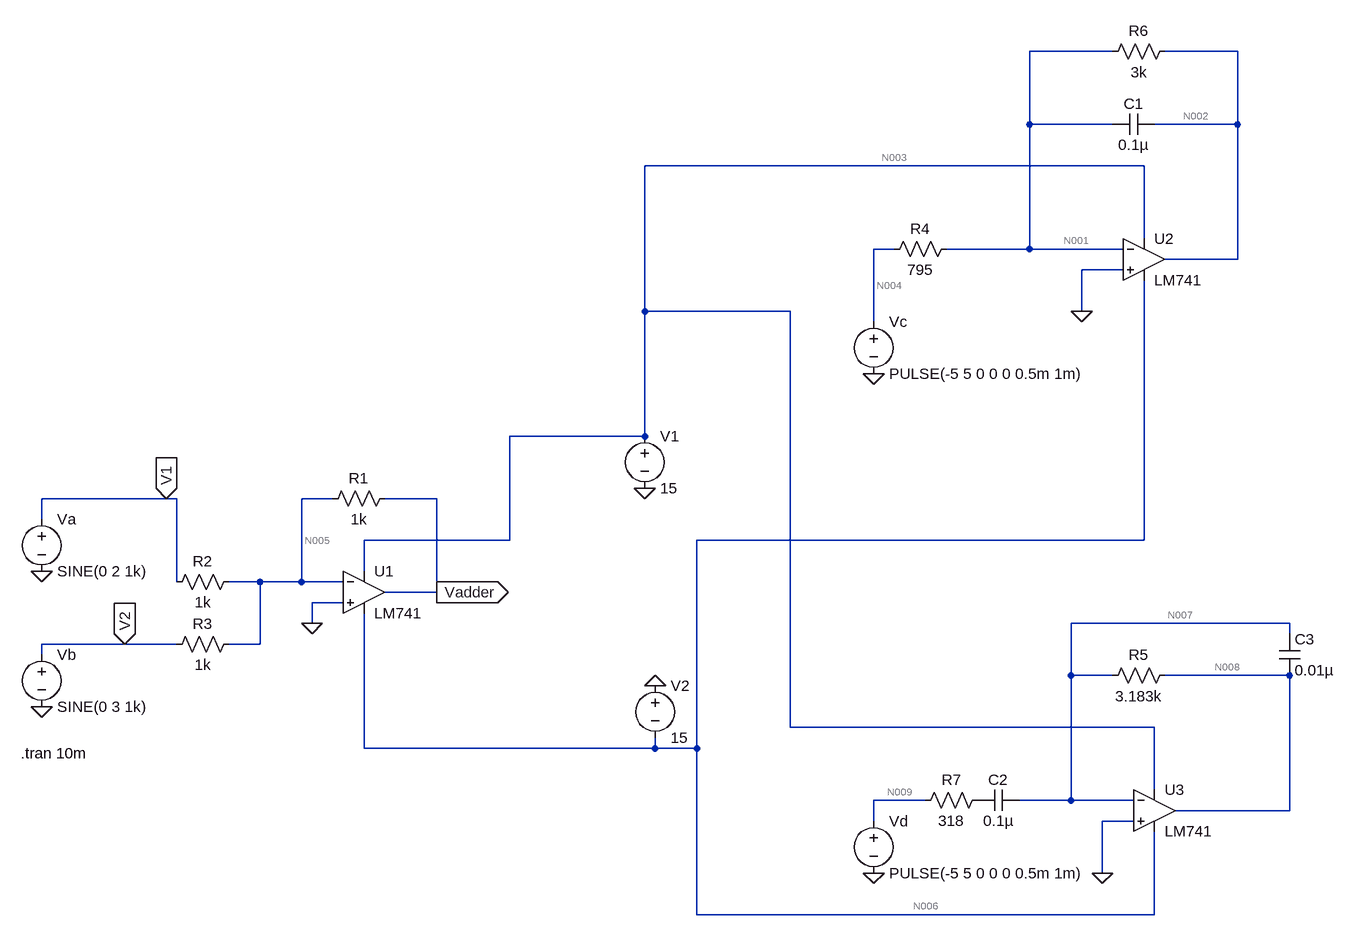
[diagram p0: schematic Opamp_Math_applications.asc]
Opamp_Math_applications.asc, the LTspice schematic file:
Version 4
SHEET 1 1788 680
WIRE 1440 -656 1312 -656
WIRE 1632 -656 1520 -656
WIRE 1312 -544 1312 -656
WIRE 1440 -544 1312 -544
WIRE 1632 -544 1632 -656
WIRE 1632 -544 1504 -544
WIRE 1488 -480 720 -480
WIRE 1488 -368 1488 -480
WIRE 1104 -352 1072 -352
WIRE 1312 -352 1312 -544
WIRE 1312 -352 1184 -352
WIRE 1456 -352 1312 -352
WIRE 1632 -336 1632 -544
WIRE 1632 -336 1520 -336
WIRE 1456 -320 1392 -320
WIRE 720 -256 720 -480
WIRE 944 -256 720 -256
WIRE 1392 -256 1392 -320
WIRE 1072 -240 1072 -352
WIRE 720 -64 720 -256
WIRE 720 -64 512 -64
WIRE -16 32 -208 32
WIRE 0 32 -16 32
WIRE 240 32 192 32
WIRE 400 32 320 32
WIRE -208 64 -208 32
WIRE 512 96 512 -64
WIRE 512 96 288 96
WIRE 1488 96 1488 -304
WIRE 1488 96 800 96
WIRE 288 144 288 96
WIRE 0 160 0 32
WIRE 128 160 80 160
WIRE 192 160 192 32
WIRE 192 160 128 160
WIRE 256 160 192 160
WIRE 400 176 400 32
WIRE 400 176 320 176
WIRE 256 192 208 192
WIRE 208 224 208 192
WIRE 1712 224 1376 224
WIRE 1712 240 1712 224
WIRE -80 256 -208 256
WIRE 0 256 -80 256
WIRE 128 256 128 160
WIRE 128 256 80 256
WIRE -208 272 -208 256
WIRE 1376 304 1376 224
WIRE 1440 304 1376 304
WIRE 1712 304 1520 304
WIRE 944 384 944 -256
WIRE 1504 384 944 384
WIRE 288 416 288 208
WIRE 736 416 736 400
WIRE 736 416 288 416
WIRE 800 416 800 96
WIRE 800 416 736 416
WIRE 1504 480 1504 384
WIRE 1152 496 1072 496
WIRE 1376 496 1376 304
WIRE 1376 496 1296 496
WIRE 1472 496 1376 496
WIRE 1712 512 1712 304
WIRE 1712 512 1536 512
WIRE 1072 528 1072 496
WIRE 1472 528 1424 528
WIRE 1424 608 1424 528
WIRE 800 672 800 416
WIRE 1504 672 1504 544
WIRE 1504 672 800 672
FLAG 736 320 0
FLAG 720 16 0
FLAG 208 224 0
FLAG 400 176 Vadder
IOPIN 400 176 Out
FLAG -208 144 0
FLAG -208 352 0
FLAG -16 32 V1
IOPIN -16 32 In
FLAG -80 256 V2
IOPIN -80 256 In
FLAG 1392 -256 0
FLAG 1424 608 0
FLAG 1072 608 0
FLAG 1072 -160 0
SYMBOL OpAmps\\LM741 288 112 R0
SYMATTR InstName U1
SYMBOL voltage 720 -80 R0
SYMATTR InstName V1
SYMATTR Value 15
SYMBOL voltage 736 304 R0
SYMATTR InstName V2
SYMATTR Value 15
SYMBOL res 336 16 R90
WINDOW 0 0 56 VBottom 2
WINDOW 3 32 56 VTop 2
SYMATTR InstName R1
SYMATTR Value 1k
SYMBOL res 96 144 R90
WINDOW 0 0 56 VBottom 2
WINDOW 3 32 56 VTop 2
SYMATTR InstName R2
SYMATTR Value 1k
SYMBOL res 96 240 R90
WINDOW 0 0 56 VBottom 2
WINDOW 3 32 56 VTop 2
SYMATTR InstName R3
SYMATTR Value 1k
SYMBOL voltage -208 48 R0
WINDOW 123 0 0 Left 0
WINDOW 39 0 0 Left 0
SYMATTR InstName Va
SYMATTR Value SINE(0 2 1k)
SYMBOL voltage -208 256 R0
WINDOW 123 0 0 Left 0
WINDOW 39 0 0 Left 0
SYMATTR InstName Vb
SYMATTR Value SINE(0 3 1k)
SYMBOL OpAmps\\LM741 1488 -400 R0
SYMATTR InstName U2
SYMBOL OpAmps\\LM741 1504 448 R0
SYMATTR InstName U3
SYMBOL res 1200 -368 R90
WINDOW 0 0 56 VBottom 2
WINDOW 3 32 56 VTop 2
SYMATTR InstName R4
SYMATTR Value 795
SYMBOL res 1536 288 R90
WINDOW 0 0 56 VBottom 2
WINDOW 3 32 56 VTop 2
SYMATTR InstName R5
SYMATTR Value 3.183k
SYMBOL cap 1504 -560 R90
WINDOW 0 0 32 VBottom 2
WINDOW 3 32 32 VTop 2
SYMATTR InstName C1
SYMATTR Value 0.1µ
SYMBOL cap 1296 480 R90
WINDOW 0 0 32 VBottom 2
WINDOW 3 32 32 VTop 2
SYMATTR InstName C2
SYMATTR Value 0.1µ
SYMBOL voltage 1072 -256 R0
WINDOW 123 0 0 Left 0
WINDOW 39 0 0 Left 0
SYMATTR InstName Vc
SYMATTR Value PULSE(-5 5 0 0 0 0.5m 1m)
SYMBOL voltage 1072 512 R0
WINDOW 123 0 0 Left 0
WINDOW 39 0 0 Left 0
SYMATTR InstName Vd
SYMATTR Value PULSE(-5 5 0 0 0 0.5m 1m)
SYMBOL res 1536 -672 R90
WINDOW 0 0 56 VBottom 2
WINDOW 3 32 56 VTop 2
SYMATTR InstName R6
SYMATTR Value 3k
SYMBOL res 1248 480 R90
WINDOW 0 0 56 VBottom 2
WINDOW 3 32 56 VTop 2
SYMATTR InstName R7
SYMATTR Value 318
SYMBOL cap 1696 240 R0
SYMATTR InstName C3
SYMATTR Value 0.01µ
TEXT -240 424 Left 2 !.tran 10m

The netlist it stands for:
* Opamp_Math_applications.asc
XU1 0 N005 N003 N006 Vadder LM741  ; pins In+ In- V+ V- OUT
V1 N003 0 15
V2 0 N006 15
R1 Vadder N005 1k
R2 N005 V1 1k
R3 N005 V2 1k
Va V1 0 SINE(0 2 1k)
Vb V2 0 SINE(0 3 1k)
XU2 0 N001 N003 N006 N002 LM741  ; pins In+ In- V+ V- OUT
XU3 0 N007 N003 N006 N008 LM741  ; pins In+ In- V+ V- OUT
R4 N001 N004 795
R5 N008 N007 3.183k
C1 N002 N001 0.1µ
C2 N007 P001 0.1µ
Vc N004 0 PULSE(-5 5 0 0 0 0.5m 1m)
Vd N009 0 PULSE(-5 5 0 0 0 0.5m 1m)
R6 N002 N001 3k
R7 P001 N009 318
C3 N007 N008 0.01µ
.tran 10m
.lib LM741.lib
.backanno
.end

* Results of the author's LTspice run, read from the files saved beside the schematic
* Operating Point, zero values left out:
*   V(n005) = 1 mV
*   V(n006) = -15 V
*   V(n003) = 15 V
*   V(vadder) = 3.102 mV
*   V(n001) = -1.061 V
*   V(n002) = 13.8 V
*   V(n007) = 1 mV
*   V(n008) = 1.324 mV
*   V(n004) = -5 V
*   V(p001) = -5 V
*   V(n009) = -5 V
*   I(R6) = 4.953 mA
*   I(R5) = 101.9 nA
*   I(R4) = 4.955 mA
*   I(R3) = 1 µA
*   I(R2) = 1 µA
*   I(R1) = 2.102 µA
*   I(Vc) = 4.955 mA
*   I(Vb) = 1 µA
*   I(Va) = 1 µA
*   I(V2) = -5.026 mA
*   I(V1) = -9.981 mA
*   Ix(u1:1) = 57.86 nA
*   Ix(u1:2) = 101.9 nA
*   Ix(u1:99) = 1.702 mA
*   Ix(u1:50) = -1.7 mA
*   Ix(u1:28) = -2.102 µA
*   Ix(u2:1) = 2.262 µA
*   Ix(u2:2) = -2.102 µA
*   Ix(u2:99) = 6.578 mA
*   Ix(u2:50) = -1.625 mA
*   Ix(u2:28) = -4.953 mA
*   Ix(u3:1) = 57.86 nA
*   Ix(u3:2) = 101.9 nA
*   Ix(u3:99) = 1.701 mA
*   Ix(u3:50) = -1.701 mA
*   Ix(u3:28) = -101.9 nA
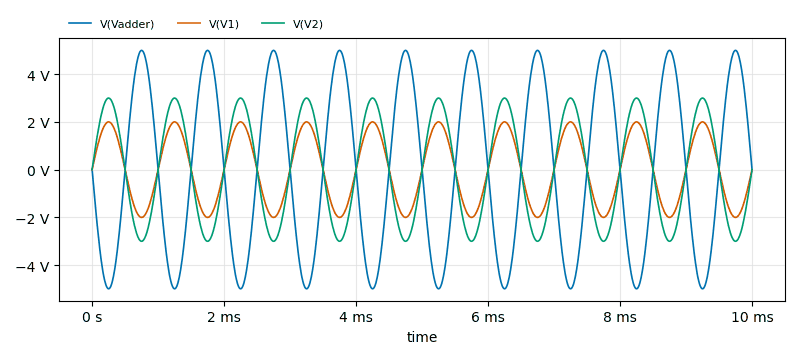
[diagram p1: Transient Analysis of Opamp_Math_applications.asc, plotted from the saved traces]
* Transient Analysis, 1 run:
*   V(Vadder): min -4.992 V, max 4.999 V, average 3.156 mV, rms 3.532 V, last 20.85 mV
*   V(V1): min -2 V, max 2 V, average 23.68 µV, rms 1.414 V, last 0 V
*   V(V2): min -3 V, max 3 V, average 35.52 µV, rms 2.121 V, last 0 V